# Altium schematic sheet CAN 5V0.SchDoc
size A
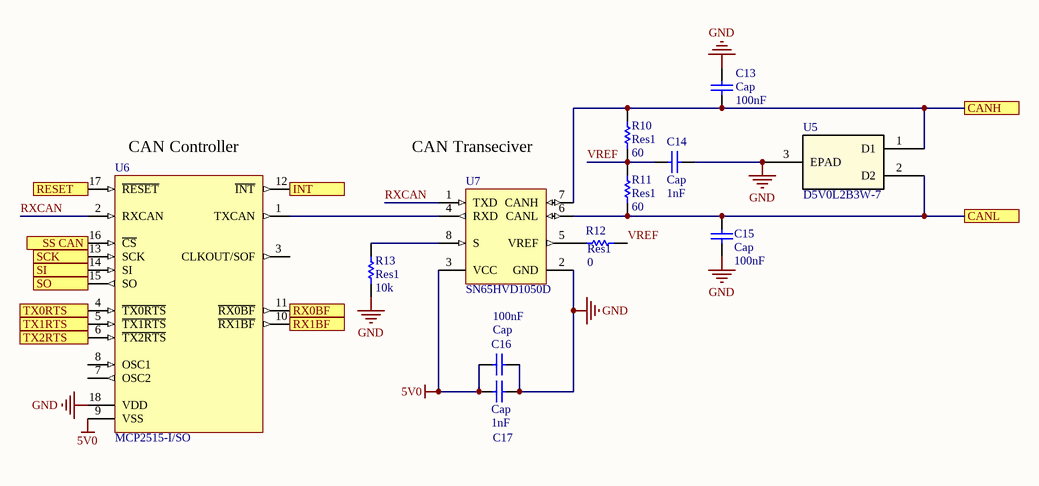
[diagram p0: CAN 5V0.SchDoc]

## Parts
C13  Cap  value 100nF  [RAD-0.3]
C14  Cap  value 1nF  [RAD-0.3]
C15  Cap  value 100nF  [RAD-0.3]
C16  Cap  value 100nF  [RAD-0.3]
C17  Cap  value 1nF  [RAD-0.3]
R10  Res1  value 60  [AXIAL-0.3]
R11  Res1  value 60  [AXIAL-0.3]
R12  Res1  value 0  [AXIAL-0.3]
R13  Res1  value 10k  [AXIAL-0.3]
U5  D5V0L2B3W-7  [SOT-323_DIO]
U6  MCP2515-I/SO  [SOIC-SO18_L]
U7  SN65HVD1050D  [D0008A_N]

## Ports
CANH, CANL, INT (out), RESET (in), RX0BF (out), RX1BF (out), SCK (in), SI (in), SO (out), SS CAN (out), TX0RTS (in), TX1RTS (in), TX2RTS (in)

## Nets
5V0: C16.1 C17.2 U6.9(VSS) U7.3(VCC)
GND: C13.1 C14.2 C15.1 C16.2 C17.1 R13.1 U5.3(EPAD) U6.18(VDD) U7.2(GND)
CANH: C13.2 R10.1 U5.1(D1) U7.7(CANH) ; port CANH
CANL: C15.2 R11.1 U5.2(D2) U7.6(CANL) ; port CANL
INT: U6.12(~{INT}) ; port INT
RESET: U6.17(~{RESET}) ; port RESET
RX0BF: U6.11(~{RX0BF}) ; port RX0BF
RX1BF: U6.10(~{RX1BF}) ; port RX1BF
RXCAN: U6.2(RXCAN) U7.1(TXD)
SCK: U6.13(SCK) ; port SCK
SI: U6.14(SI) ; port SI
SO: U6.15(SO) ; port SO
SS CAN: U6.16(~{CS}) ; port SS CAN
TX0RTS: U6.4(~{TX0RTS}) ; port TX0RTS
TX1RTS: U6.5(~{TX1RTS}) ; port TX1RTS
TX2RTS: U6.6(~{TX2RTS}) ; port TX2RTS
VREF: C14.1 R10.2 R11.2 R12.2
NetR12_1: R12.1 U7.5(VREF)
NetR13_2: R13.2 U7.8(S)
NetU6_1: U6.1(TXCAN) U7.4(RXD)

Not connected (* = marked no-connect by the designer): U6 3(CLKOUT/SOF) 7(OSC2) 8(OSC1)

## Notes on the sheet
- (near U6) CAN Controller
- (near U7) CAN Transeciver

## Library data of the parts
C13-C17 = Cap: Capacitor; Published: 8-Jun-2000; LatestRevisionDate: 17-Jul-2002; LatestRevisionNote: Re-released for DXP Platform.; PackageReference: RAD-0.3; Publisher: Altium Limited; PackageDescription: Radial Cap, Thru-Hole; 2 Leads; 0.3 in Pin Spacing
R10-R13 = Res1: Resistor; Published: 8-Jun-2000; LatestRevisionDate: 17-Jul-2002; LatestRevisionNote: Re-released for DXP Platform.; PackageReference: AXIAL-0.3; Publisher: Altium Limited; PackageDescription: Axial Device, Thru-Hole; 2 Leads; 0.3 in Pin Spacing
U5 = D5V0L2B3W-7: No Description Available; Vendor: Diodes Inc; Built_By: EMA_UL_Team; SourceLibrary: DIODESINC_2_2015-08-18; Manufacturer_Part_Number: D5V0L2B3W-7; Copyright: Copyright (C) 2018 Accelerated Designs. All rights reserved; RefDes: RefDes; Type: DEV
U6 = CMP-0186-00133-2: Stand-Alone CAN Controller With SPI Interface, 18-Pin SOIC, Industrial Temperature; ComponentLink2Description: Datasheet; RevisionNote: URLs added. DatasheetVersion updated.; PackageVersion: revBB, Aug-2009; ComponentLink1URL: http://www.microchip.com/; PackageReference: SOIC-SO18; PackageDescription: 18-Lead Plastic Small Outline (SO) - Wide 7.50mm Body [SOIC]; DatasheetVersion: revF, Oct-2010; ComponentLink2URL: http://ww1.microchip.com/downloads/en/DeviceDoc/21801f.pdf; ComponentLink3URL: http://www.microchip.com/stellent/groups/techpub_sg/documents/packagingspec/en012702.pdf; Code_JEDEC: MS-013; ComponentLink3Description: Package Specification; ComponentLink1Description: Manufacturer URL
U7 = CMP-0315-00048-2: High-Speed EMC Optimized CAN Transceiver, 70 mA, 5 V, -40 to 125 degC, 8-pin SOIC (D), Green (RoHS & no Sb/Br); Manufacturer: Texas Instruments; Bus Fault Voltage(V): -4 to 16; Rating: Catalog; Drivers Per Package: 1; Transient Pulse Protection(V): -200 to 200; ICC(Max)(mA): 70; Supply Voltage(s)(V): 5; PackageVersion: revM, Jun-2011; PartNumber: SN65HVD1050D; PackageReference: D0008A; Code_JEDEC: MS-012AA; Isolated: No; ComponentLink1Description: Datasheet; PackageDescription: 8-Pin Plastic Small Outline Integrated Circuit, 4.9 x 3.9 mm, Pitch 1.27 mm Pitch; Receivers Per Package: 1; Footprint: TJA1050; DatasheetVersion: SLLS632B; SubFamily: CAN; ComponentLink1URL: http://www.ti.com/general/docs/lit/getliterature.tsp?genericPartNumber=SN65HVD1050&fileType=pdf; Eco-Plan: Green (RoHS & no Sb/Br); Mounting Technology: Surface Mount